# EAGLE design Power_Switch (EAGLE 9.6.2)
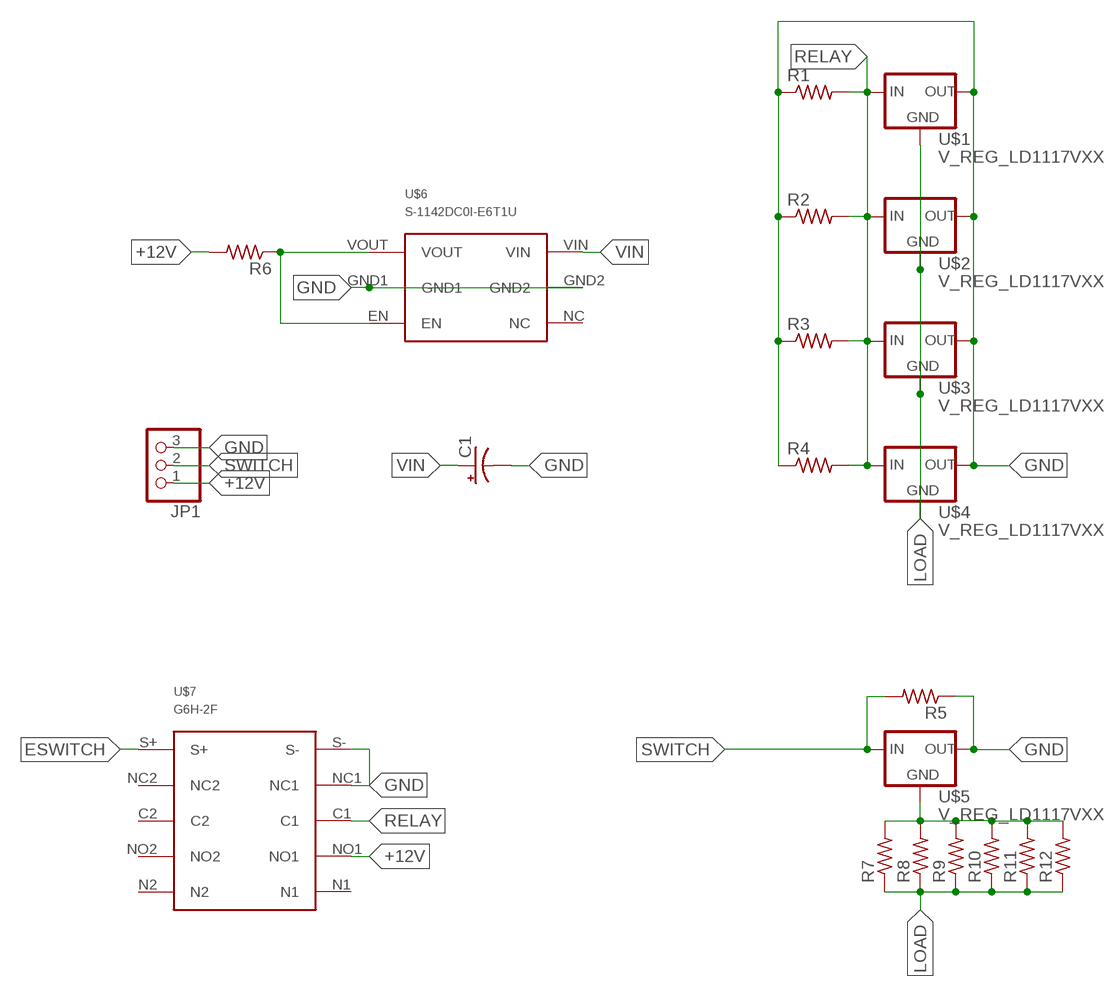
[diagram p0: schematic, sheet 1]

## Parts
C1  CPOL-US153CLV-0810  [153CLV-0810]
JP1  PINHD-1X3  [1X03]
R1  R-US_R0805  [R0805]
R2  R-US_R0805  [R0805]
R3  R-US_R0805  [R0805]
R4  R-US_R0805  [R0805]
R5  R-US_R0805  [R0805]
R6  R-US_R0805  [R0805]
R7  R-US_R0805  [R0805]
R8  R-US_R0805  [R0805]
R9  R-US_R0805  [R0805]
R10  R-US_R0805  [R0805]
R11  R-US_R0805  [R0805]
R12  R-US_R0805  [R0805]
U$1  V_REG_LD1117VXX  [78XXL]
U$2  V_REG_LD1117VXX  [78XXL]
U$3  V_REG_LD1117VXX  [78XXL]
U$4  V_REG_LD1117VXX  [78XXL]
U$5  V_REG_LD1117VXX  [78XXL]
U$6  S-1142DC0I-E6T1U  [S-1142DC0I-E6T1U]
U$7  G6H-2F  [G6H-2F]

## Nets
+12V: JP1.1 R6.2 U$7.NO1
ESWITCH: U$7.S+
GND: C1.- JP1.3 R1.1 R2.1 R3.1 R4.1 R5.1 U$1.OUT U$2.OUT U$3.OUT U$4.OUT U$5.OUT U$6.GND1 U$6.GND2 U$7.NC1 U$7.S-
LOAD: R7.1 R8.1 R9.1 R10.1 R11.1 R12.1 U$1.GND U$2.GND U$3.GND U$4.GND
N$1: R6.1 U$6.EN U$6.VOUT
N$2: R7.2 R8.2 R9.2 R10.2 R11.2 R12.2 U$5.GND
RELAY: R1.2 R2.2 R3.2 R4.2 U$1.IN U$2.IN U$3.IN U$4.IN U$7.C1
SWITCH: JP1.2 R5.2 U$5.IN
VIN: C1.+ U$6.VIN
Unconnected: U$6.NC U$7.C2 U$7.N1 U$7.N2 U$7.NC2 U$7.NO2

## Library data of the parts
C1 = adafruit:CPOL-US: POLARIZED CAPACITOR, American symbol
JP1 = adafruit:PINHD-1X3: PIN HEADER
R1-R12 = adafruit:R-US_: RESISTOR, American symbol
U$1-U$5 = SparkFun-IC-Power:V_REG_LD1117VXX: LD1117VXX voltage regulator. We carry the 3.3V version (COM-00526) in TO-220 package.
U$6 = SkateboardLib:S-1142DC0I-E6T1U
U$7 = SkateboardLib:G6H-2F

## Board
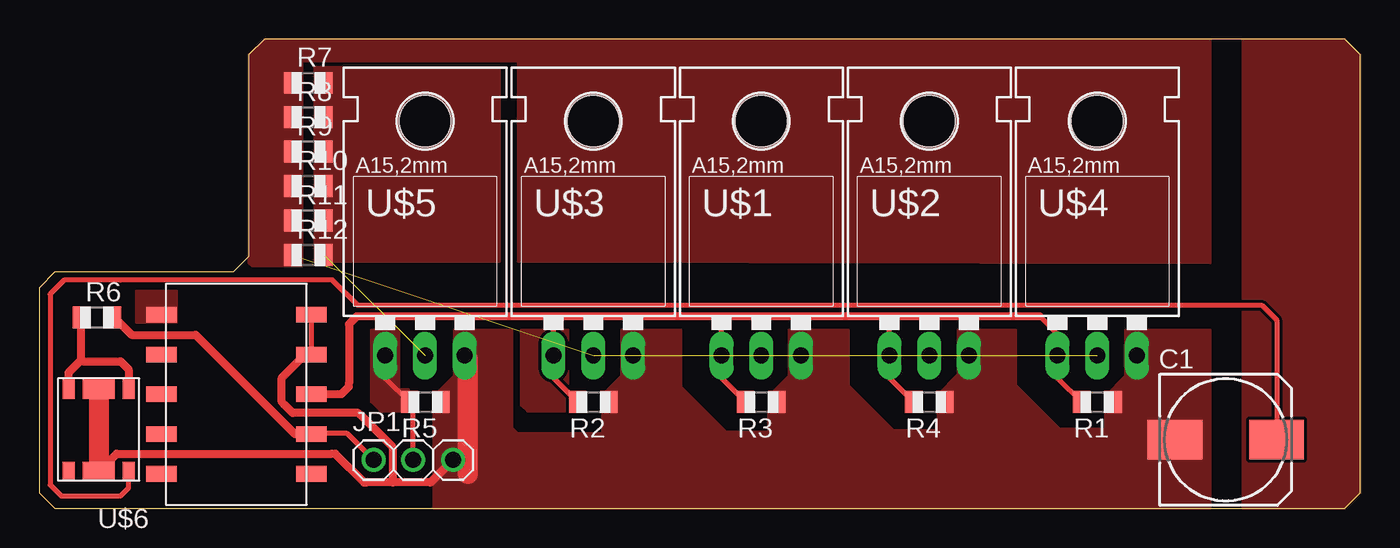
[diagram p1: board, top side]

Size 84.4 x 30 mm. Coordinates in mm from the lower left corner, seen from the top.
Outline: 0,14.1 0,1 1,0 83.4,0 84.4,1 84.4,29 83.4,30 14.4,30 13.4,29 13.4,16.1 12.4,15.1 1,15.1 0,14.1
Copper layers (1*16): Top 0.035mm / dielectric 1.5mm / Bottom 0.035mm
Design rules "default *": minimum track width 6mil, minimum drill 0.35mm, track to track 8mil, track to pad 8mil, pad to pad 8mil, via to via 8mil, smd to smd 6mil, copper to edge 0mil, drill to drill 6mil, minimum pad ring 10mil, minimum via ring 8mil, stop-mask expansion 4mil, vias tented up to drill 0mil, thermal gap 10mil

### Footprints (pad centres in the part's own frame; a part is rotated, then mirrored left to right if it is on the bottom)
153CLV-0810 = smd 3.5 x 2.5: + 3.25,0; - -3.25,0
1X03 = drill 1.016: 1 -2.54,0; 2 0,0; 3 2.54,0
R0805 = smd 1.1 x 1.4: 1 -1,0; 2 1,0
78XXL = drill 1.016 long: GND 0,-3.81; IN -2.54,-3.81; OUT 2.54,-3.81 | hole 3.302: 0,11.176
S-1142DC0I-E6T1U = smd 0.76 x 1.27: EN 1.91,-2.64; NC 1.91,2.64; VIN -1.91,2.64; VOUT -1.91,-2.64 | smd 2.03 x 1.27: GND1 0,-2.64; GND2 0,2.64
G6H-2F = smd 1 x 1.94: C1 0,4.78; C2 0,-4.78; N1 5.08,4.78; N2 5.08,-4.78; NC1 -2.54,4.78; NC2 -2.54,-4.78; NO1 2.54,4.78; NO2 2.54,-4.78; S+ -5.08,-4.78; S- -5.08,4.78

### Placement (x,y rotation side)
C1  75.8,4.4 0 top
JP1  23.9,3.1 0 top
R1  67.6,6.8 180 top
R2  35.4,6.8 180 top
R3  46.13,6.8 180 top
R4  56.86,6.8 180 top
R5  24.67,6.8 180 top
R6  3.7,12.2 0 top
R7  17.2,27.2 0 top
R8  17.2,25 0 top
R9  17.2,22.8 0 top
R10  17.2,20.6 0 top
R11  17.2,18.4 0 top
R12  17.2,16.2 0 top
U$1  46.13,13.58 0 top
U$2  56.86,13.58 0 top
U$3  35.4,13.58 0 top
U$4  67.59,13.58 0 top
U$5  24.65,13.58 0 top
U$6  3.8,5 180 top
U$7  12.6,7.3 270 top

### Tracks (layer width: path | path; a pad name or v marks a point on that pad's centre or on a via)
+12V
  Top 0.305: JP1.1 19.66,4.8 17.42,4.8 U$7.NO1 17.1,4.76
  Top 0.508: R6.2 4.8,12.2 5.9,11.1 9.99,11.1 16.33,4.76 17.1,4.76
ESWITCH
  pour Top (no thermals): 8.8,11.9 8.8,13.9 6.2,13.9 6.2,11.9
GND
  Top 0.305: U$7.S- U$7.NC1 17.2,9.84 | 20.9,1.66 20.76,1.66 | 18.7,3.5 18.92,3.5 | 15.65,6.65 15.5,6.8 | 20.5,6 20.4,6.1 | 22.6,1.66 22.6,2
  Top 0.508: JP1.3 25,1.66 22.6,1.66 20.9,1.66 | 22.6,2 22.6,3.9 20.5,6 | 20.4,6.1 16.2,6.1 15.65,6.65 | 15.5,6.8 15.5,8.36 16.98,9.84 17.2,9.84 | U$6.GND2 4.94,3.5 18.7,3.5 | 18.92,3.5 20.76,1.66
  Top 1.27: 27.4,2.2 27.4,9.58 | U$6.GND1 U$6.GND2
  pour Top (no thermals): 26.5,11.4 26.5,8.5 25.2,7.2 25.2,0 74.8,0 74.8,11.4 69.4,11.4 69.4,8.5 68.1,7.2 68.1,5.1 65.2,5.1 62.4,7.9 62.4,11.4 58.7,11.4 58.7,8.6 57.4,7.3 57.4,5 54.6,5 51.7,7.9 51.7,11.4 47.9,11.4 47.9,8.5 46.6,7.2 46.6,4.9 43.9,4.9 41,7.8 41,11.4 37.2,11.4 37.2,8.5 36,7.3 36,4.8 30.6,4.8 30.2,5.2 30.2,11.4
LOAD  (4 unrouted)
  pour Top (rank 2, no thermals): 74.8,30 14.4,30 13.4,29 13.4,15.7 13.6,15.5 16.8,15.5 16.8,28.6 30.6,28.6 30.6,15.8 74.8,15.7
N$1
  Top 0.305: 2.6,9.4 5.2,9.4
  Top 0.508: U$6.EN 1.89,8.69 2.6,9.4 | U$6.VOUT 5.71,8.89 5.2,9.4 2.8,9.4 2.7,9.5 R6.1
N$2  (1 unrouted)
  pour Top (no thermals): 29.4,15.8 29.4,28.2 17.6,28.2 17.6,15.8
RELAY
  Top 0.305: R2.2 32.86,8.34 U$3.IN 32.86,11.86 33.3,12.3 | R3.2 43.59,8.34 U$1.IN 43.59,12.29 43.6,12.3 | R4.2 54.32,8.34 U$2.IN 54.32,12.22 54.4,12.3 | 33.3,12.3 43.6,12.3 | 43.6,12.3 54.4,12.3 | 54.4,12.3 63.92,12.3 65.05,11.17 U$4.IN 65.05,8.35 R1.2 | 19.79,8 19.79,7.79 | 19.85,11.85 19.79,11.79 | 21.8,12.3 33.3,12.3
  Top 0.508: 63.92,12.3 21.8,12.3 20.3,12.3 19.85,11.85 | 19.79,11.79 19.79,8 | 19.79,7.79 19.3,7.3 U$7.C1
SWITCH
  Top 0.305: U$5.IN 22.11,8.36 R5.2 23.9,6.57 JP1.2
  pour Top (no thermals): 23,11.4 21.2,11.4 21.2,6.8 21.8,6.2 23.6,6.2 23.6,7.6 23,7.6
  pour Top (no thermals): 33.8,11.4 30.8,11.4 30.8,6.6 31.2,6.2 33.8,6.2
VCC
  pour Top: 76.9,30 76.9,0 83.4,0 84.4,1 84.4,29 83.4,30
VIN
  Top 0.305: C1.+ 79.05,12.05 78.1,13 20.33,13 18.73,14.61 5.19,14.61 5.18,14.6 1.6,14.6 0.7,13.7 0.7,1.5 1.4,0.8 5.2,0.8 5.71,1.31 U$6.VIN